# EAGLE design TunnelingAmp (EAGLE 7.6.0)
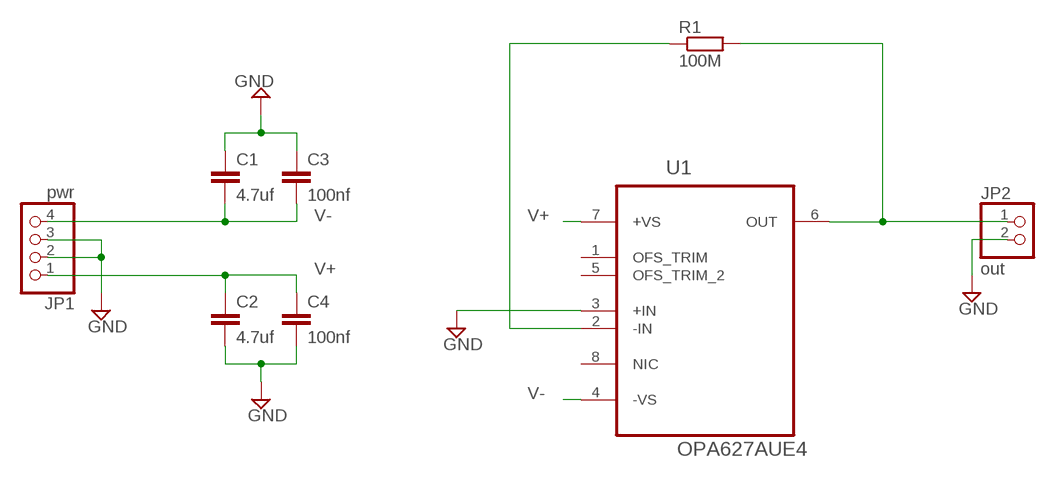
[diagram p0: schematic, sheet 1]

## Parts
C1  4.7uf  C-EUC1210  [C1210]
C2  4.7uf  C-EUC1210  [C1210]
C3  100nf  C-EUC0603  [C0603]
C4  100nf  C-EUC0603  [C0603]
JP1  pwr  PINHD-1X4  [1X04]
JP2  out  PINHD-1X2  [1X02]
R1  100M  R-EU_R0805  [R0805]
U1  OPA627AUE4  [SOIC127P600X175-8N]

## Nets
GND: C1.1 C2.2 C3.1 C4.2 JP1.2 JP1.3 JP2.2 U1.3(+IN)
N$5: R1.1 U1.2(-IN)
N$6: JP2.1 R1.2 U1.6(OUT)
V+: C2.1 C4.1 JP1.1 U1.7(+VS)
V-: C1.2 C3.2 JP1.4 U1.4(-VS)
Unconnected: U1.1(OFS_TRIM) U1.5(OFS_TRIM_2) U1.8(NIC)

## Library data of the parts
C1-C4 = resistor:C-EU: CAPACITOR, European symbol
JP1 = pinhead:PINHD-1X4: PIN HEADER
JP2 = pinhead:PINHD-1X2: PIN HEADER
R1 = resistor:R-EU_: RESISTOR, European symbol
U1 = OPA627_FromFarnell:OPA627AUE4: OPERATIONAL AMPLIFIERS; MPN: OPA627AUE4; OC_FARNELL: 1207067; OC_NEWARK: 97K6855; PACKAGE: SOIC-8; SUPPLIER: TI

## Board
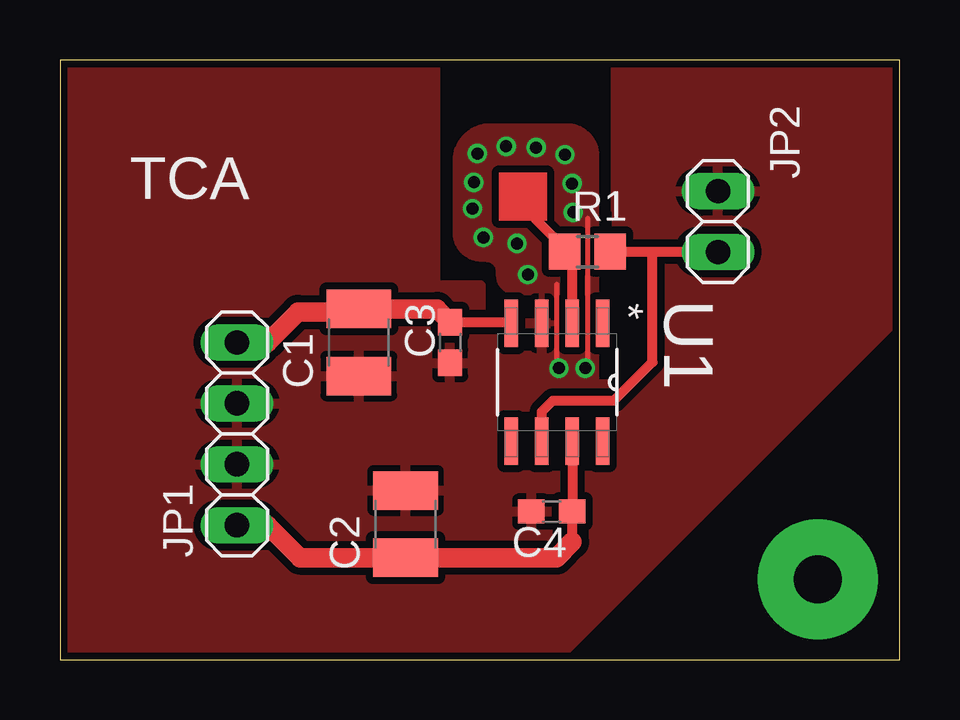
[diagram p1: board, top side]
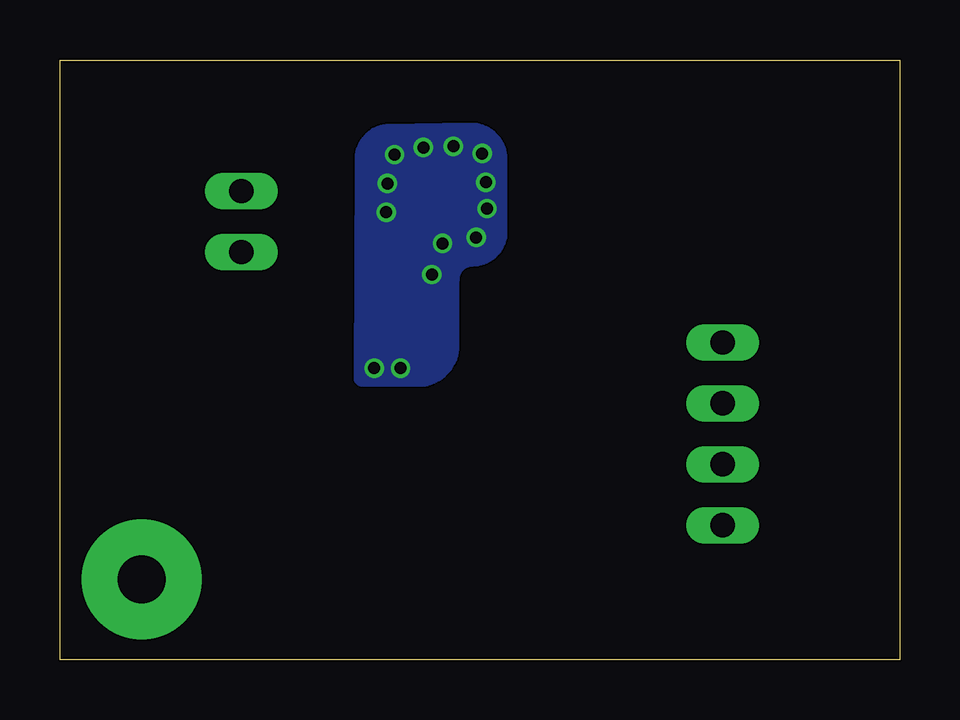
[diagram p2: board, bottom side, seen from below]

Size 35 x 25 mm. Coordinates in mm from the lower left corner, seen from the top.
Outline: 0,0 35,0 35,25 0,25 0,0
Copper layers (1*16): Top 0.035mm / dielectric 1.5mm / Bottom 0.035mm
Design rules "ITead_rule": minimum track width 6mil, minimum drill 12mil, track to track 6mil, track to pad 6mil, pad to pad 6mil, via to via 6mil, smd to smd 0mil, copper to edge 10mil, drill to drill 10mil, minimum pad ring 10mil, minimum via ring 6mil, stop-mask expansion 2mil, vias tented up to drill 100mil, thermal gap 10mil

### Footprints (pad centres in the part's own frame; a part is rotated, then mirrored left to right if it is on the bottom)
C1210 = smd 1.6 x 2.7: 1 -1.4,0; 2 1.4,0
C0603 = smd 1.1 x 1: 1 -0.85,0; 2 0.85,0
1X04 = drill 1.016 long: 1 -3.81,0; 2 -1.27,0; 3 1.27,0; 4 3.81,0
1X02 = drill 1.016 long: 1 -1.27,0; 2 1.27,0
R0805 = smd 1.3 x 1.5: 1 -0.95,0; 2 0.95,0
SOIC127P600X175-8N = smd 1.981 x 0.559: 1 -2.464,1.905; 2 -2.464,0.635; 3 -2.464,-0.635; 4 -2.464,-1.905; 5 2.464,-1.905; 6 2.464,-0.635; 7 2.464,0.635; 8 2.464,1.905

### Placement (x,y rotation side)
C1  12.46,13.22 90 top
C2  14.41,5.65 90 top
C3  16.27,13.22 90 top
C4  20.5,6.17 180 top
JP1  7.38,9.41 90 top
JP2  27.43,18.26 90 top
R1  21.99,17.01 0 top
U1  20.72,11.56 270 top

### Tracks (layer width: path | path; a pad name or v marks a point on that pad's centre or on a via)
GND  (via drill 0.5)
  Top 0.2: 20.7,15.65 20.7,12.5 | 22,12.5 22,18.4
  other vias: 17.4,21.1 17.2,18.8 17.65,17.6 19.05,17.35 21.35,19.85 19.85,21.35 21.05,21.05 18.6,21.4 20.8,12.15 21.9,12.15 19.5,16.05 17.25,19.9 21.4,18.65
  pour Top (isolate 0.305): 0,0 20.7,0 35,14.3 35,25 23.15,24.95 23.15,18.8 23.2,18.8 23.2,11.5 20.3,11.4 20.25,14.55 17.55,14.55 17.55,15.6 15.65,15.6 15.65,25 0,25
  pour Bottom: 22.51,20.77 22.55,11.8 arc-90 22.45,11.6 20.1,11.57 arc-91 18.55,13.1 18.55,15.84 arc90 17.79,16.6 arc-90 16.55,17.84 16.55,20.86 arc-91 17.89,22.18 21.37,22.12 arc-89
  pour Top (isolate 0.305): 19.7,15.3 19.04,15.3 arc-90 18.3,16.04 18.3,16.16 arc90 17.76,16.7 17.6,16.7 arc-90 16.5,17.8 16.5,20.8 arc-90 17.95,22.25 21.1,22.25 arc-90 22.35,21 22.35,11.6 19.7,11.6
N$2  (via drill 2 pad 5)
  other vias: 31.6,3.35
N$5
  Top 0.254: 20.6,17 R1.1
  Top 0.406: U1.2 21.36,16.7 R1.1 | 20.6,17 20.6,17.6 19,19.2
N$6
  Top 0.406: R1.2 24.65,17.01 | 24.65,17.01 27.41,17.01 JP2.1 | U1.6 20.09,10.34 20.55,10.8 23.1,10.8 24.7,12.4 24.7,16.96 24.65,17.01
V+
  Top 0.406: JP1.1 8.65,5.6 | U1.7 21.36,5.78 C4.1 21.35,4.9
  Top 0.813: 8.65,5.6 10,4.25 C2.1 20.7,4.25 21.35,4.9
V-
  Top 0.406: JP1.4 8.65,13.22 | 12.33,14.49 C1.2 | C3.2 18.77,14.07 U1.4
  Top 0.813: 8.65,13.22 9.92,14.49 12.33,14.49 | C1.2 15.72,14.62 C3.2
(copper drawn outside any net)
  shapes: Top area x1

### Text on the board
tPlace: TCA